# Altium schematic sheet RS485_FD.SchDoc
size A4
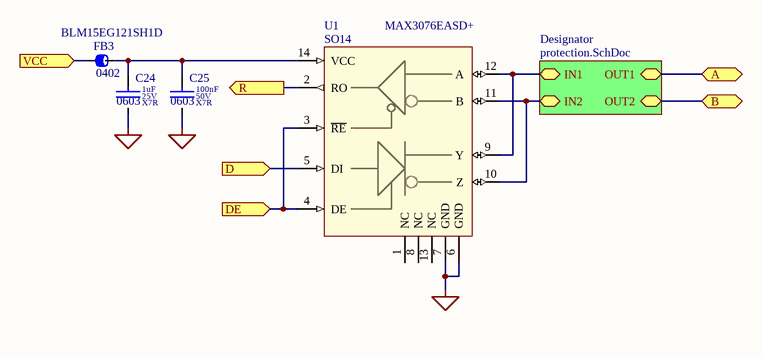
[diagram p0: RS485_FD.SchDoc]

## Parts
C24  value 1uF  Dielectric: X7R  Voltage: 25V  SCH_Footprint: 0603  [C_0603_1608]  (hidden comment: Ceramic X7R)
C25  value 100nF  Dielectric: X7R  Voltage: 50V  SCH_Footprint: 0603  [C_0603_1608]  (hidden comment: Ceramic X7R)
FB3  SCH_Footprint: 0402  Manufacturer Part Number: BLM15EG121SH1D  [FB_0402_1005]  (hidden comment: Ferrite bead)
U1  value MAX3076EASD+  SCH_Footprint: SO14  [SOP14_SO14_SOIC14_4X9X18]  (hidden comment: MAX3076 Series 16 Mbps 6 V Full Duplex SMT RS 485 Transceiver - SOIC-14)

## Sub-sheets
Designator = protection.SchDoc: OUT2 (bidir), IN1 (bidir), IN2 (bidir), OUT1 (bidir)

## Ports
A (bidir), B (bidir), D (in), DE (in), R (out), VCC (in)

## Nets
GND: C24.2 C25.2 U1.6(GND) U1.7(GND)
A: port A, sheet Designator/OUT1
B: port B, sheet Designator/OUT2
D: U1.5(DI) ; port D
DE: U1.3(~{RE}) U1.4(DE) ; port DE
R: U1.2(RO) ; port R
VCC: FB3.1 ; port VCC
NetC24_1: C24.1 C25.1 FB3.2 U1.14(VCC)
NetU1_9: U1.9(Y) U1.12(A) ; sheet Designator/IN1
NetU1_10: U1.10(Z) U1.11(B) ; sheet Designator/IN2

Not connected (* = marked no-connect by the designer): U1 1(NC) 8(NC) 13(NC)

## Library data of the parts
C24 = C_1uF_25V_X7R_0603_10: Capacitor; Manufacturer: Samsung; Manufacturer Part Number: CL10B105KA8NNNC; Tolerance (%): 10; Part Number: C_1uF_25V_X7R_0603_10; HelpURL: http://www.tme.eu/pl/Document/4a42202b32dab16128fe107dd69598cc/samsung-chip-cap.pdf; Supplier 1: TME; Supplier Part Number 1: CL10B105KA8NNNC; Supplier 2: RS Components; Supplier 3: Farnell; Supplier 4: Mouser; Supplier 5: Digi-Key
C25 = C_100nF_50V_X7R_0603_5: Capacitor; Manufacturer: Samsung; Manufacturer Part Number: CL10B104JB8NNNC; Tolerance (%): 5; Part Number: C_100nF_50V_X7R_0603_5; HelpURL: http://www.tme.eu/pl/Document/4a42202b32dab16128fe107dd69598cc/samsung-chip-cap.pdf; Supplier 1: TME; Supplier Part Number 1: CL10B104JB8NNNC; Supplier 2: RS Components; Supplier 3: Farnell; Supplier 4: Mouser; Supplier 5: Digi-Key
FB3 = FB_BLM15EG121SH1D: Manufacturer: Murata; Current: 1.5A; Resistance: 95mR; Part Number: FB_BLM15EG121SH1D; Value: BLM15EG121SH1D; HelpURL: http://datasheet.octopart.com/BLM15EG121SH1D-Murata-datasheet-37129980.pdf; Supplier 1: TME; Supplier 2: RS Components; Supplier 3: Farnell; Supplier 4: Mouser; Supplier Part Number 4: 81-BLM15EG121SH1D; Supplier 5: Digi-Key; Supplier Part Number 5: 490-17344-1-ND
U1 = U_MAX3076EASD+: RS-485/RS-422 Transceivers, +3.3V,  ±15kV ESD-Protected, Fail-Safe, Hot-Swap; Manufacturer: Maxim Integrated; Part Number: U_MAX3076EASD+; HelpURL: https://sigma.octopart.com/138901689/technical_drawing/Maxim-Integrated-MAX3076EASD%2B.pdf; Manufacturer Part Number: MAX3076EASD+; Supplier 1: TME; Supplier 2: RS Components; Supplier 3: Farnell; Supplier Part Number 3: 2511650; Supplier 4: Mouser; Supplier Part Number 4: 700-MAX3076EASD; Supplier 5: Digi-Key; Supplier Part Number 5: MAX3076EASD+-ND